# EAGLE design eTapper1main46 (EAGLE 8.4.3)
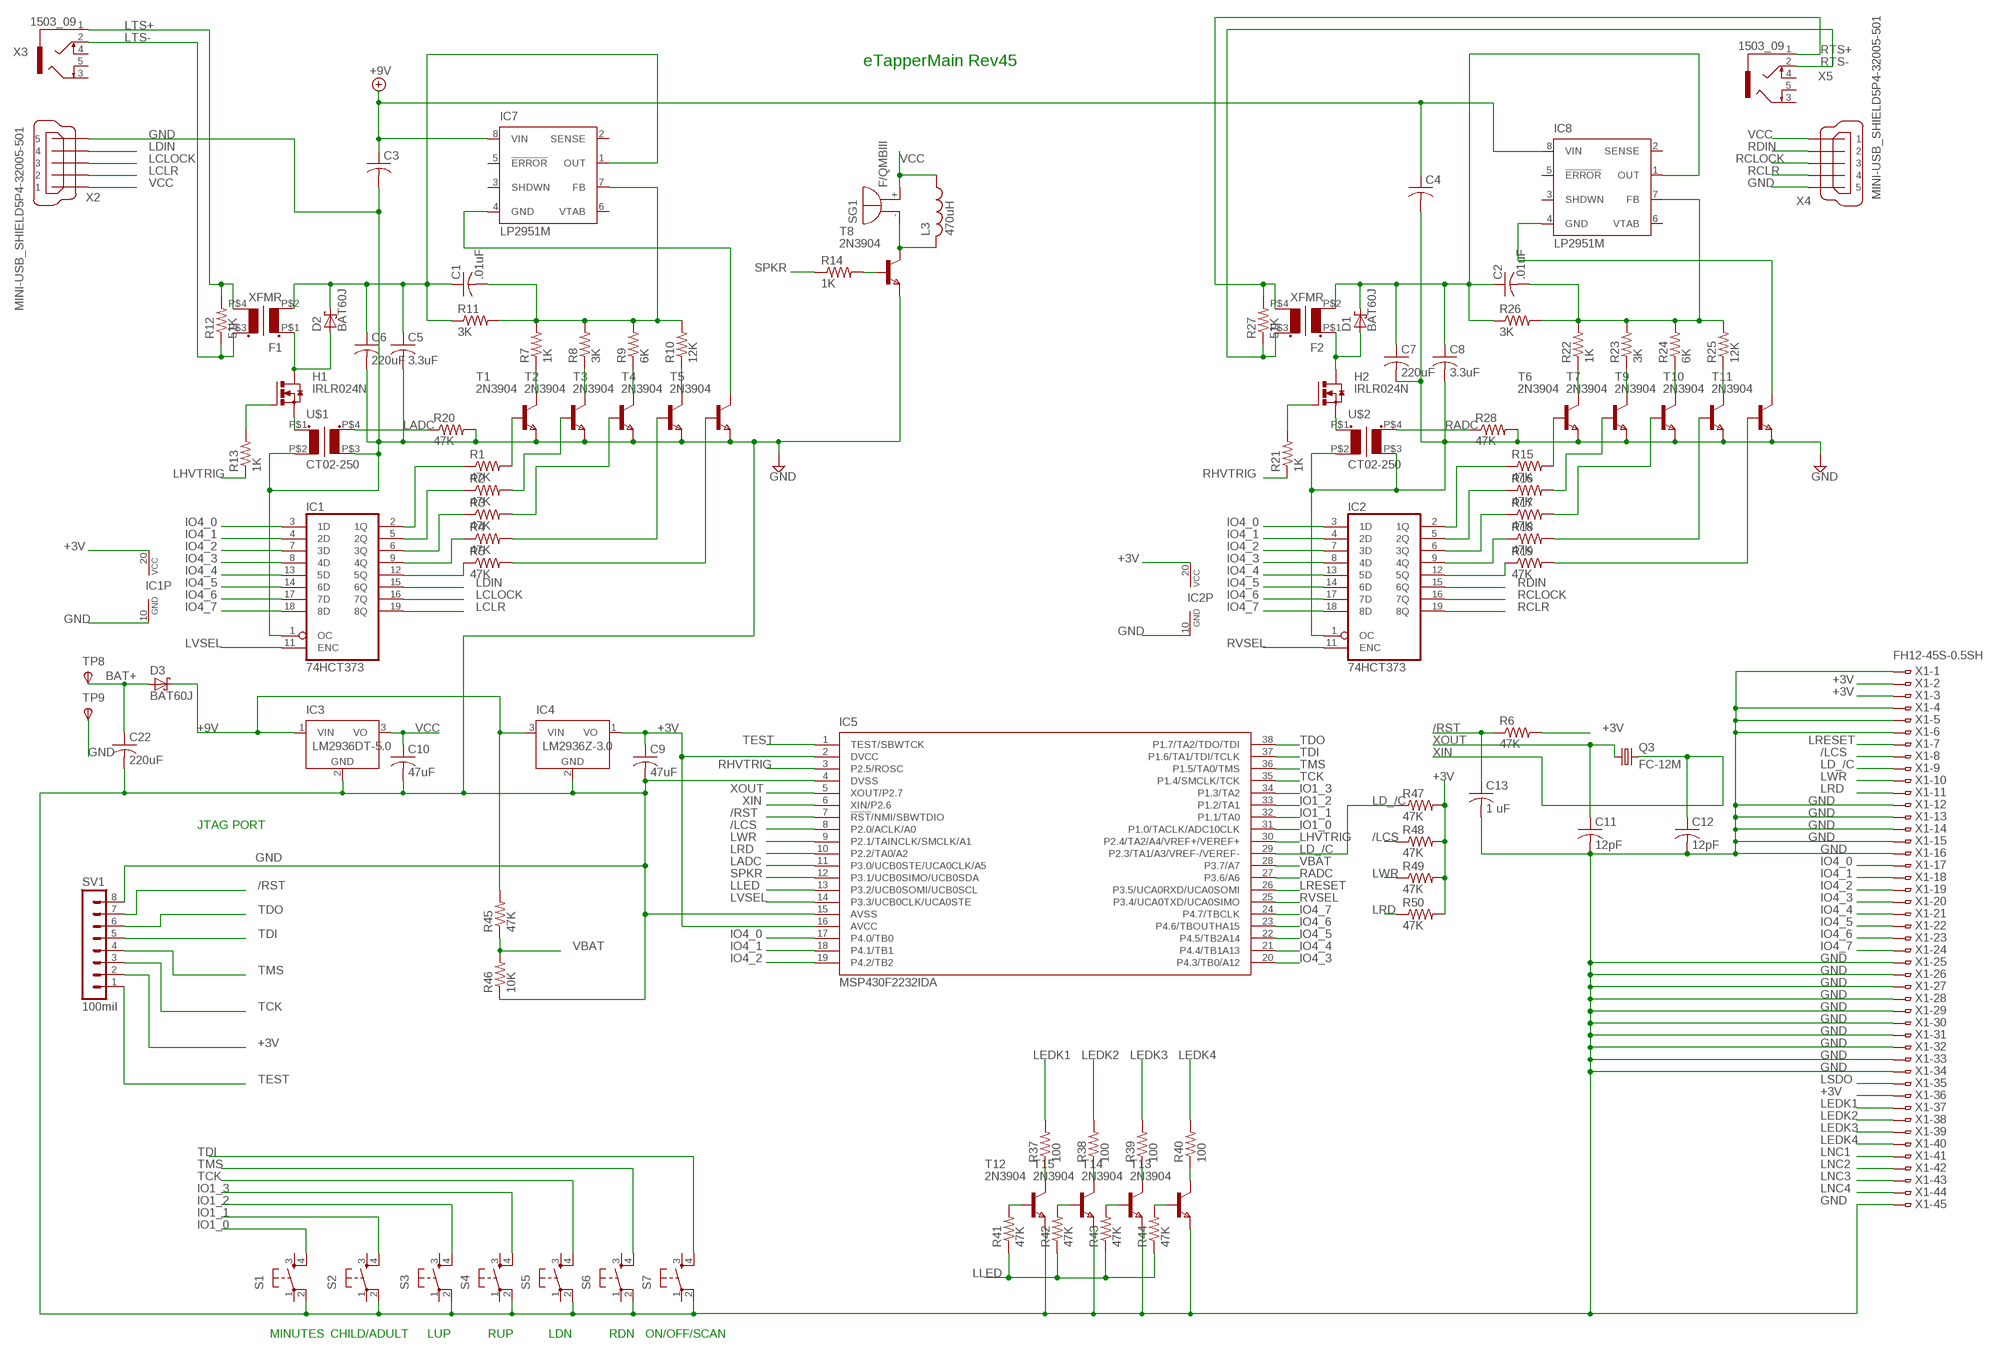
[diagram p0: schematic, sheet 1]

## Parts
C1  .01uF  C-USC0805  [C0805]
C2  .01uF  C-USC0805  [C0805]
C3  C-USC1206  [C1206]
C4  C-USC1206  [C1206]
C5  3.3uF  C-USC0805  [C0805]
C6  220uF  C-USC1206  [C1206]
C7  220uF  C-USC1206  [C1206]
C8  3.3uF  C-USC0805  [C0805]
C9  47uF  C-USC1206  [C1206]
C10  47uF  C-USC1206  [C1206]
C11  12pF  C-USC0805  [C0805]
C12  12pF  C-USC0805  [C0805]
C13  1 uF  C-USC0805  [C0805]
C22  220uF  C-USC1206  [C1206]
D1  BAT60J  [SOD323_ST]
D2  BAT60J  [SOD323_ST]
D3  BAT60J  [SOD323_ST]
F1  XFMR  [XFMR]
F2  XFMR  [XFMR]
H1  IRLR024N  [D-PAK_TO252AA]
H2  IRLR024N  [D-PAK_TO252AA]
IC1  74HCT373  [SO20]
IC2  74HCT373  [SO20]
IC3  LM2936DT-5.0  [TO252]
IC4  LM2936Z-3.0  [TO92]
IC5  MSP430F2232IDA  [TSSOP38_R-PDSO-G38-DA]
IC7  LP2951M  [SO08]
IC8  LP2951M  [SO08]
L3  470uH  L-USL2825P  [L2825P]
Q3  FC-12M  [FC-12M]
R1  47K  R-US_R0402  [R0402]
R2  47K  R-US_R0402  [R0402]
R3  47K  R-US_R0402  [R0402]
R4  47K  R-US_R0402  [R0402]
R5  47K  R-US_R0402  [R0402]
R6  47K  R-US_R0402  [R0402]
R7  1K  R-US_R0402  [R0402]
R8  3K  R-US_R0402  [R0402]
R9  6K  R-US_R0402  [R0402]
R10  12K  R-US_R0402  [R0402]
R11  3K  R-US_R0402  [R0402]
R12  51K  R-US_R0402  [R0402]
R13  1K  R-US_R0402  [R0402]
R14  1K  R-US_R0402  [R0402]
R15  47K  R-US_R0402  [R0402]
R16  47K  R-US_R0402  [R0402]
R17  47K  R-US_R0402  [R0402]
R18  47K  R-US_R0402  [R0402]
R19  47K  R-US_R0402  [R0402]
R20  47K  R-US_R0402  [R0402]
R21  1K  R-US_R0402  [R0402]
R22  1K  R-US_R0402  [R0402]
R23  3K  R-US_R0402  [R0402]
R24  6K  R-US_R0402  [R0402]
R25  12K  R-US_R0402  [R0402]
R26  3K  R-US_R0402  [R0402]
R27  51K  R-US_R0402  [R0402]
R28  47K  R-US_R0402  [R0402]
R37  100  R-US_R0402  [R0402]
R38  100  R-US_R0402  [R0402]
R39  100  R-US_R0402  [R0402]
R40  100  R-US_R0402  [R0402]
R41  47K  R-US_R0402  [R0402]
R42  47K  R-US_R0402  [R0402]
R43  47K  R-US_R0402  [R0402]
R44  47K  R-US_R0402  [R0402]
R45  47K  R-US_R0402  [R0402]
R46  10K  R-US_R0402  [R0402]
R47  47K  R-US_R0402  [R0402]
R48  47K  R-US_R0402  [R0402]
R49  47K  R-US_R0402  [R0402]
R50  47K  R-US_R0402  [R0402]
S1  10-XX  [B3F-10XX]
S2  10-XX  [B3F-10XX]
S3  10-XX  [B3F-10XX]
S4  10-XX  [B3F-10XX]
S5  10-XX  [B3F-10XX]
S6  10-XX  [B3F-10XX]
S7  10-XX  [B3F-10XX]
SG1  F/QMBIII  [F/QMBIII]
SV1  100mil  MA08-1  [MA08-1]
T1  2N3904  NPNSOT23  [SOT-23]
T2  2N3904  NPNSOT23  [SOT-23]
T3  2N3904  NPNSOT23  [SOT-23]
T4  2N3904  NPNSOT23  [SOT-23]
T5  2N3904  NPNSOT23  [SOT-23]
T6  2N3904  NPNSOT23  [SOT-23]
T7  2N3904  NPNSOT23  [SOT-23]
T8  2N3904  NPNSOT23  [SOT-23]
T9  2N3904  NPNSOT23  [SOT-23]
T10  2N3904  NPNSOT23  [SOT-23]
T11  2N3904  NPNSOT23  [SOT-23]
T12  2N3904  NPNSOT23  [SOT-23]
T13  2N3904  NPNSOT23  [SOT-23]
T14  2N3904  NPNSOT23  [SOT-23]
T15  2N3904  NPNSOT23  [SOT-23]
TP8  TPSPAD1-20  [P1-20]
TP9  TPSPAD1-20  [P1-20]
U$1  CT02-250  [CT02-250]
U$2  CT02-250  [CT02-250]
X1  FH12-45S-0.5SH  [FH12-45S-0.5SH]
X2  MINI-USB_SHIELD5P4-32005-501  [32005-501]
X3  1503_09  [1503_09]
X4  MINI-USB_SHIELD5P4-32005-501  [32005-501]
X5  1503_09  [1503_09]

## Nets
+3V [+3V]: C9.1 IC1.20(VCC) IC2.20(VCC) IC4.1(VO) IC5.2(DVCC) IC5.16(AVCC) R6.2 R47.2 R48.2 R49.2 R50.2 SV1.2 X1.2 X1.3 X1.36
+9V [+9V]: C3.1 C4.1 D3.C IC3.1(VIN) IC4.3(VIN) IC7.8(VIN) IC8.8(VIN) R45.2
/LCS: IC5.8(P2.0/ACLK/A0) R48.1 X1.8
/RST: C13.1 IC5.7(!RST!/NMI/SBWTDIO) R6.1 SV1.7
BAT+ [BAT+]: C22.1 D3.A TP8.TP(PP)
GND [GND]: C3.2 C4.2 C5.2 C6.2 C7.2 C8.2 C9.2 C10.2 C11.2 C12.2 C13.2 C22.2 IC1.1(OC) IC1.10(GND) IC2.1(OC) IC2.10(GND) IC3.2(GND) IC4.2(GND) IC5.4(DVSS) IC5.15(AVSS) R20.2 R28.2 R46.1 S1.2(P1) S2.2(P1) S3.2(P1) S4.2(P1) S5.2(P1) S6.2(P1) S7.2(P1) SV1.8 T1.2(E) T2.2(E) T3.2(E) T4.2(E) T5.2(E) T6.2(E) T7.2(E) T8.2(E) T9.2(E) T10.2(E) T11.2(E) T12.2(E) T13.2(E) T14.2(E) T15.2(E) TP9.TP(PP) U$1.P$2(P2) U$1.P$3(S2) U$2.P$2(P2) U$2.P$3(S2) X1.1 X1.4 X1.5 X1.6 X1.12 X1.13 X1.14 X1.15 X1.16 X1.25 X1.26 X1.27 X1.28 X1.29 X1.30 X1.31 X1.32 X1.33 X1.34 X1.45 X2.5 X4.5
IO1_0: IC5.31(P1.0/TACLK/ADC10CLK) S1.4(S1)
IO1_1: IC5.32(P1.1/TA0) S2.4(S1)
IO1_2: IC5.33(P1.2/TA1) S3.4(S1)
IO1_3: IC5.34(P1.3/TA2) S4.4(S1)
IO4_0: IC1.3(1D) IC2.3(1D) IC5.17(P4.0/TB0) X1.17
IO4_1: IC1.4(2D) IC2.4(2D) IC5.18(P4.1/TB1) X1.18
IO4_2: IC1.7(3D) IC2.7(3D) IC5.19(P4.2/TB2) X1.19
IO4_3: IC1.8(4D) IC2.8(4D) IC5.20(P4.3/TB0/A12) X1.20
IO4_4: IC1.13(5D) IC2.13(5D) IC5.21(P4.4/TB1A13) X1.21
IO4_5: IC1.14(6D) IC2.14(6D) IC5.22(P4.5/TB2A14) X1.22
IO4_6: IC1.17(7D) IC2.17(7D) IC5.23(P4.6/TBOUTHA15) X1.23
IO4_7: IC1.18(8D) IC2.18(8D) IC5.24(P4.7/TBCLK) X1.24
LADC: IC5.11(P3.0/UCB0STE/UCA0CLK/A5) R20.1 U$1.P$4(S1)
LCLOCK: IC1.16(7Q) X2.3
LCLR: IC1.19(8Q) X2.2
LD_/C: IC5.29(P2.3/TA1/A3/VREF-/VEREF-) R47.1 X1.9
LDIN: IC1.15(6Q) X2.4
LEDK1: R37.2 X1.37
LEDK2: R38.2 X1.38
LEDK3: R39.2 X1.39
LEDK4: R40.2 X1.40
LHVTRIG: IC5.30(P2.4/TA2/A4/VREF+/VEREF+) R13.1
LLED: IC5.13(P3.2/UCB0SOMI/UCB0SCL) R41.1 R42.1 R43.1 R44.1
LNC1: X1.41
LNC2: X1.42
LNC3: X1.43
LNC4: X1.44
LRD: IC5.10(P2.2/TA0/A2) R50.1 X1.11
LRESET: IC5.26(P3.5/UCA0RXD/UCA0SOMI) X1.7
LSDO: X1.35
LTS+: F1.P$4(S2) R12.2 X3.1
LTS-: F1.P$3(S1) R12.1 X3.2
LVSEL: IC1.11(ENC) IC5.14(P3.3/UCB0CLK/UCA0STE)
LWR: IC5.9(P2.1/TAINCLK/SMCLK/A1) R49.1 X1.10
N$1: IC1.2(1Q) R1.1
N$2: IC1.5(2Q) R2.1
N$3: IC1.6(3Q) R3.1
N$4: IC1.9(4Q) R4.1
N$5: IC1.12(5Q) R5.1
N$6: L3.2 SG1.-(+) T8.1(C)
N$7: R4.2 T4.3(B)
N$8: R5.2 T5.3(B)
N$9: D2.A F1.P$1(P1) H1.4(D)
N$10: R7.1 T1.1(C)
N$11: R8.1 T2.1(C)
N$12: R9.1 T3.1(C)
N$13: R1.2 T1.3(B)
N$14: R2.2 T2.3(B)
N$15: R3.2 T3.3(B)
N$16: R10.1 T4.1(C)
N$17: C1.2 IC7.7(FB) R7.2 R8.2 R9.2 R10.2 R11.2
N$18: C1.1 C5.1 C6.1 D2.C F1.P$2(P2) IC7.1(OUT) R11.1
N$19: D1.A F2.P$1(P1) H2.4(D)
N$20: IC2.2(1Q) R15.1
N$21: H1.1(G) R13.2
N$22: R14.2 T8.3(B)
N$23 [GND]: H1.3(S) U$1.P$1(P1)
N$24: IC2.5(2Q) R16.1
N$25: IC2.6(3Q) R17.1
N$26: IC2.9(4Q) R18.1
N$27: IC2.12(5Q) R19.1
N$28: R44.2 T13.3(B)
N$29: R15.2 T6.3(B)
N$30: R16.2 T7.3(B)
N$31: R17.2 T9.3(B)
N$32: R18.2 T10.3(B)
N$33: R19.2 T11.3(B)
N$35: R22.1 T6.1(C)
N$36: R23.1 T7.1(C)
N$37: R24.1 T9.1(C)
N$38: R25.1 T10.1(C)
N$39: C2.2 IC8.7(FB) R22.2 R23.2 R24.2 R25.2 R26.2
N$40: C2.1 C7.1 C8.1 D1.C F2.P$2(P2) IC8.1(OUT) R26.1
N$41: R37.1 T12.1(C)
N$42: H2.1(G) R21.2
N$43: R38.1 T15.1(C)
N$44: R39.1 T14.1(C)
N$45: IC7.4(GND) T5.1(C)
N$46: R40.1 T13.1(C)
N$47: IC8.4(GND) T11.1(C)
N$48: R43.2 T14.3(B)
N$49: R41.2 T12.3(B)
N$50: R42.2 T15.3(B)
N$51 [GND]: H2.3(S) U$2.P$1(P1)
RADC: IC5.27(P3.6/A6) R28.1 U$2.P$4(S1)
RCLOCK: IC2.16(7Q) X4.3
RCLR: IC2.19(8Q) X4.4
RDIN: IC2.15(6Q) X4.2
RHVTRIG: IC5.3(P2.5/ROSC) R21.1
RTS+: F2.P$4(S2) R27.2 X5.1
RTS-: F2.P$3(S1) R27.1 X5.2
RVSEL: IC2.11(ENC) IC5.25(P3.4/UCA0TXD/UCA0SIMO)
SPKR: IC5.12(P3.1/UCB0SIMO/UCB0SDA) R14.1
TCK: IC5.35(P1.4/SMCLK/TCK) S5.4(S1) SV1.3
TDI: IC5.37(P1.6/TA1/TDI/TCLK) S7.4(S1) SV1.5
TDO: IC5.38(P1.7/TA2/TDO/TDI) SV1.6
TEST: IC5.1(TEST/SBWTCK) SV1.1
TMS: IC5.36(P1.5/TA0/TMS) S6.4(S1) SV1.4
VBAT: IC5.28(P3.7/A7) R45.1 R46.2
VCC [VCC]: C10.1 IC3.3(VO) L3.1 SG1.+(-) X2.1 X4.1
XIN: C12.1 IC5.6(XIN/P2.6) Q3.2
XOUT: C11.1 IC5.5(XOUT/P2.7) Q3.1
Unconnected: IC7.2(SENSE) IC7.3(SHDWN) IC7.5(!ERROR) IC7.6(VTAB) IC8.2(SENSE) IC8.3(SHDWN) IC8.5(!ERROR) IC8.6(VTAB) S1.1(P) S1.3(S) S2.1(P) S2.3(S) S3.1(P) S3.3(S) S4.1(P) S4.3(S) S5.1(P) S5.3(S) S6.1(P) S6.3(S) S7.1(P) S7.3(S) X2.M1(S1) X2.M2(S2) X2.M3(S3) X2.M4(S4) X3.3 X3.4 X3.5 X4.M1(S1) X4.M2(S2) X4.M3(S3) X4.M4(S4) X5.3 X5.4 X5.5

## Notes on the sheet
- eTapperMain Rev45
- JTAG PORT
- MINUTES | CHILD/ADULT | LUP | RUP | LDN | RDN | ON/OFF/SCAN

## Library data of the parts
C1-C13 C22 = rcl:C-US: CAPACITOR, American symbol
D1-D3 = diode:BAT60J: Schottky barrier diode Source: www.st.com, BAT60J.pdf
F1 F2 = XFMR1:XFMR: Transformer 1"X1" 0.4"X0.4" hole separation for e_tapper
H1 H2 = IRLR024N:IRLR024N: IRLR024N HEXFET Power Mosfet N channel Infeneon Technology TO-251AA IPAK
IC1 IC2 = 74373_SO20:74*373: Octal D type transparent LATCH, edge triggered
IC3 = national-semiconductor:LM2936?*: Ultra-Low Quiescent Current LDO Voltage Regulator Source: Data sheet <http://www.national.com/ds/LM/LM2936.pdf>; MF: NATIONAL SEMICONDUCTOR; MPN: LM2936DT-5.0/NOPB; OC_FARNELL: 1286864; OC_NEWARK: 41K4501
IC4 = national-semiconductor:LM2936?*: Ultra-Low Quiescent Current LDO Voltage Regulator Source: Data sheet <http://www.national.com/ds/LM/LM2936.pdf>; MF: NATIONAL SEMICONDUCTOR; MPN: LM2936Z-3.0/NOPB; OC_FARNELL: 1312709; OC_NEWARK: 41K4531
IC5 = texas:MSP430F22*2IDA: MIXED SIGNAL MICROCONTROLLER Source: http://focus.ti.com/lit/ds/symlink/msp430f2274.pdf; MPN: MSP430F2232IDA; OC_FARNELL: 1610178; OC_NEWARK: 28M6312
IC7 IC8 = national-semiconductor:LP2951: Adjustable Micropower Voltage Regulator Source: http://www.national.com/ds/LP/LP2950.pdf; MF: FAIRCHILD SEMICONDUCTOR; MPN: LP2951CM; OC_FARNELL: 9488561; OC_NEWARK: 78K6014
L3 = rcl:L-US: INDUCTOR, American symbol
Q3 = crystal:FC-12M: kHz RANGE CRYSTAL UNIT LOW PROFILE SMD Source: Epson Toyocom FC-12M.pdf
R1-R28 R37-R50 = resistor:R-US_: RESISTOR, American symbol
S1-S7 = switch-omron:10-XX: OMRON SWITCH; MPN: B3F-1000; OC_FARNELL: 176432; OC_NEWARK: 36M3542
SG1 = buzzer:F/QMBIII: BUZZER Source: Buerklin; OC_FARNELL: unknown; OC_NEWARK: unknown
SV1 = con-lstb:MA08-1: PIN HEADER; OC_FARNELL: unknown; OC_NEWARK: unknown
T1-T15 = zetex:NPNSOT23: NPN TRANSISTOR; MPN: DSS20201L-7; OC_FARNELL: 1710688; OC_NEWARK: 25R4555
TP8 TP9 = testpad:TPS: TEST PIN
U$1 U$2 = CT02-250:CT02-250: Current Transformer ICE Components 1:250 turns ratio
X1 = con-hirose:FH12-45S-0.5S: 0.5mm Pitch Connectors For FPC/FFC Source: Data sheet <http://www.hirose.co.jp/cataloge_hp/e58605370.pdf>; OC_FARNELL: unknown; OC_NEWARK: unknown
X2 X4 = con-cypressindustries:MINI-USB_SHIELD5P4-: MINI USB-B R/A W/O POST 5 pol. Source: www.cypressindustries.com; OC_FARNELL: unknown; OC_NEWARK: unknown
X3 X5 = con-lumberg:1503_09: Jack connectors according to JISC 6560, 3.5 mm Klinkeneinbaukupplung nach JISC 6560, 3,5 mm, 3-polig/ stereo, abgewinkelte Ausführung, mit 2 Öffnern und Lötaugen, für Leiterplatten Rückseitenmontage Source: http://www.lumberg.com/Produkte/PDFs/1503_09.pdf; OC_FARNELL: 1243244; OC_NEWARK: unknown

## Module LP2951
Ports: 

### Library data of the parts

## Net classes
1 GND: width 0.305 mm, clearance 0.152 mm
2 BAT+: width 0.305 mm, clearance 0.152 mm
3 +9V: width 0.305 mm, clearance 0.152 mm
4 +3V: width 0.305 mm, clearance 0.152 mm
5 VCC: width 0.305 mm, clearance 0.152 mm

## Board
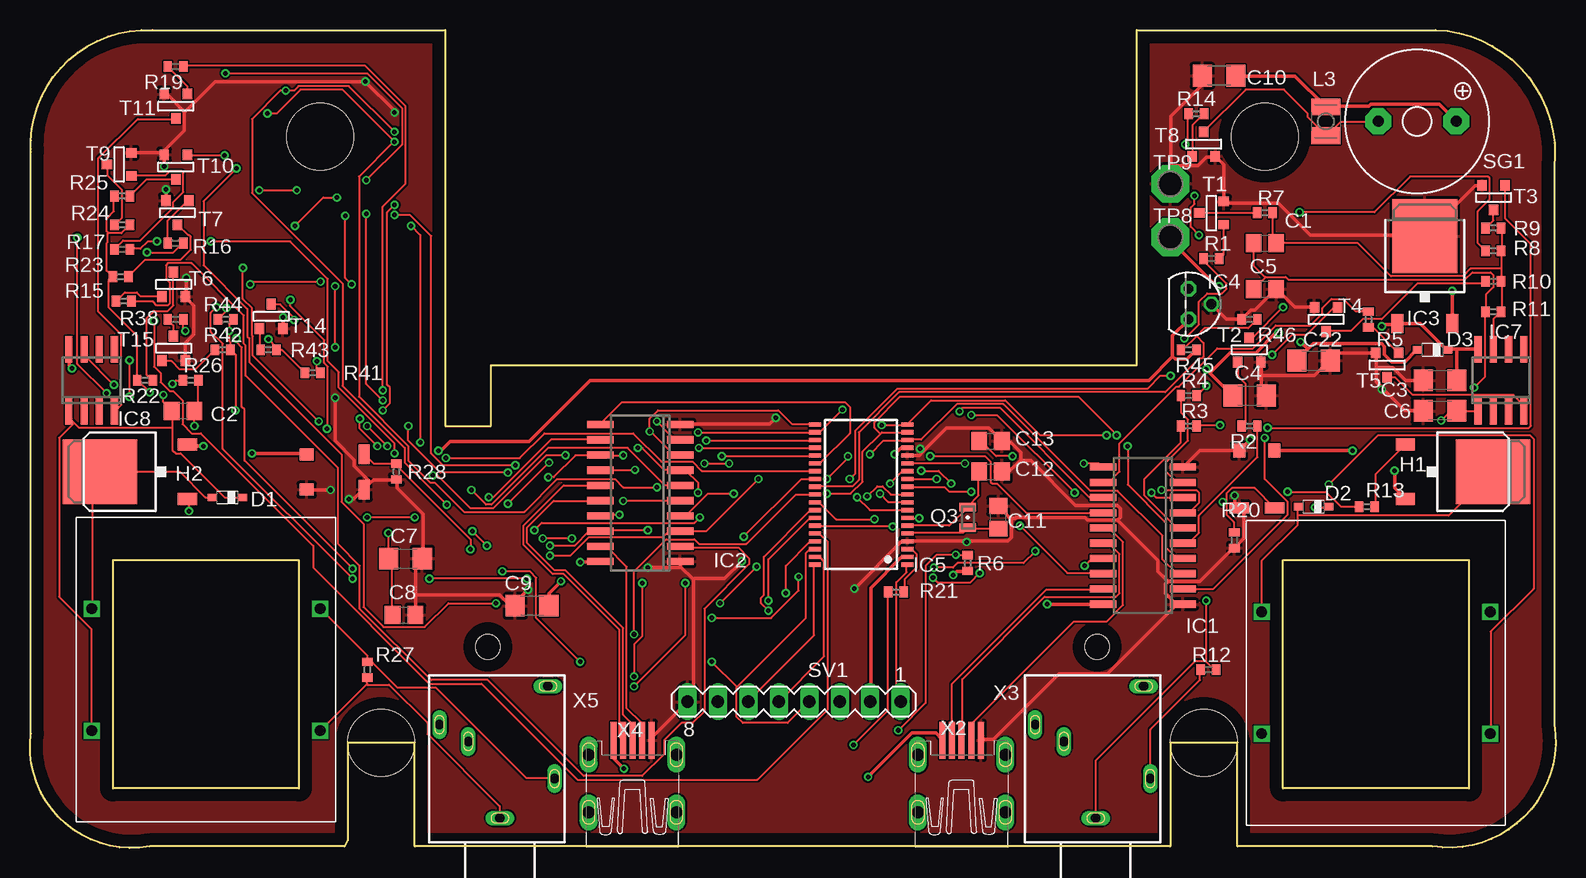
[diagram p1: board, top side]
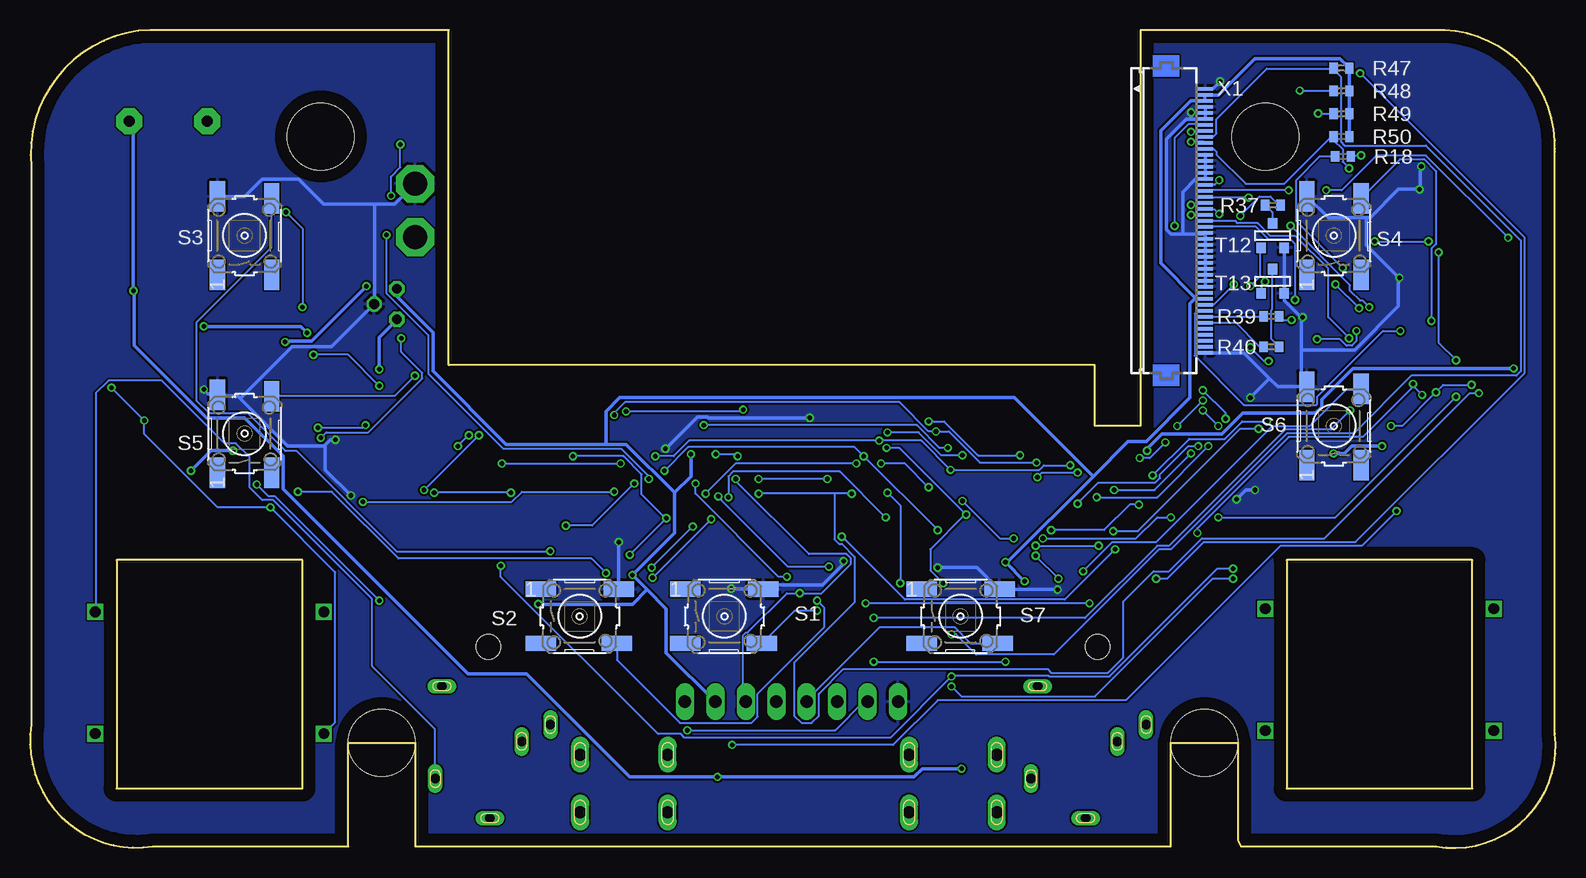
[diagram p2: board, bottom side, seen from below]

Size 127.17 x 68.21 mm. Coordinates in mm from the lower left corner, seen from the top.
Outline: 0.06,58.04 0.06,58.3 0.06,9.53
Outline: 0.06,58.04 0.06,9.53
Outline: 0.06,58.04 arc-96 10.22,68.2 34.61,68.2 34.61,35.18 38.42,35.18 38.42,40.26 92.27,40.26 92.27,68.2 117.16,68.2 arc-94 127.06,56.77 127.06,10.29 arc-108 116.9,0.13 100.65,0.13 100.65,8.77 95.06,8.77 95.06,0.13 32.07,0.13 32.07,8.77 26.48,8.77 26.48,0.64 26.23,0.13 9.97,0.13 arc-107 0.06,9.53
Outline: 104.46,24.01 119.95,24.01 119.95,4.96 104.46,4.96 104.46,24.01
Outline: 6.92,24.01 22.42,24.01 22.42,4.96 6.92,4.96 6.92,24.01
Copper layers (1*16): Top 0.035mm / dielectric 30mil / Bottom 0.035mm
Design rules "default *": minimum track width 6mil, minimum drill 15mil, track to track 6mil, track to pad 6mil, pad to pad 6mil, via to via 6mil, smd to smd 6mil, copper to edge 40mil, drill to drill 6mil, minimum pad ring 6mil, minimum via ring 6mil, stop-mask expansion 4mil, vias tented up to drill 0mil, thermal gap 10mil
Holes 5.59 mm at 24.19,59.31 102.93,59.31 29.27,8.77 97.85,8.77
Holes 2.03 mm at 38.16,16.77 88.96,16.77

### Footprints (pad centres in the part's own frame; a part is rotated, then mirrored left to right if it is on the bottom)
C0805 = smd 1.3 x 1.5: 1 -0.95,0; 2 0.95,0
C1206 = smd 1.6 x 1.8: 1 -1.4,0; 2 1.4,0
SOD323_ST = smd 0.8 x 0.6: A 1.25,0; C -1.25,0
XFMR = drill 0.889 square: P$1 -10.16,5.08; P$2 -10.16,-5.08; P$3 8.89,5.08; P$4 8.89,-5.08
D-PAK_TO252AA = smd 1 x 1.6: 1 -2.28,-4.8; 3 2.28,-4.8 | smd 5.4 x 6.2: 4 0,2.5
SO20 = smd 0.6 x 2.2: 1 -5.715,-3.33; 2 -4.445,-3.33; 3 -3.175,-3.33; 4 -1.905,-3.33; 5 -0.635,-3.33; 6 0.635,-3.33; 7 1.905,-3.33; 8 3.175,-3.33; 9 4.445,-3.33; 10 5.715,-3.33; 11 5.715,3.33; 12 4.445,3.33; 13 3.175,3.33; 14 1.905,3.33; 15 0.635,3.33; 16 -0.635,3.33; 17 -1.905,3.33; 18 -3.175,3.33; 19 -4.445,3.33; 20 -5.715,3.33
TO252 = smd 1 x 1.6: 1 -2.28,-4.8; 3 2.28,-4.8 | smd 5.4 x 6.2: 2 0,2.5
TO92 = drill 0.813 pad 1.27 octagon: 1 -1.27,0; 2 0,1.905; 3 1.27,0
TSSOP38_R-PDSO-G38-DA = smd 0.35 x 1: 1 -5.85,-3.85; 2 -5.2,-3.85; 3 -4.55,-3.85; 4 -3.9,-3.85; 5 -3.25,-3.85; 6 -2.6,-3.85; 7 -1.95,-3.85; 8 -1.3,-3.85; 9 -0.65,-3.85; 10 0,-3.85; 11 0.65,-3.85; 12 1.3,-3.85; 13 1.95,-3.85; 14 2.6,-3.85; 15 3.25,-3.85; 16 3.9,-3.85; 17 4.55,-3.85; 18 5.2,-3.85; 19 5.85,-3.85; 20 5.85,3.85; 21 5.2,3.85; 22 4.55,3.85; 23 3.9,3.85; 24 3.25,3.85; 25 2.6,3.85; 26 1.95,3.85; 27 1.3,3.85; 28 0.65,3.85; 29 0,3.85; 30 -0.65,3.85; 31 -1.3,3.85; 32 -1.95,3.85; 33 -2.6,3.85; 34 -3.25,3.85; 35 -3.9,3.85; 36 -4.55,3.85; 37 -5.2,3.85; 38 -5.85,3.85
SO08 = smd 0.6 x 2.2: 1 -1.905,-2.6; 2 -0.635,-2.6; 3 0.635,-2.6; 4 1.905,-2.6; 5 1.905,2.6; 6 0.635,2.6; 7 -0.635,2.6; 8 -1.905,2.6
L2825P = smd 1.4 x 2.4: 1 -1.2,0; 2 1.2,0
FC-12M = smd 0.7 x 1.4: 1 -0.85,0; 2 0.85,0
R0402 = smd 0.7 x 0.9: 1 -0.65,0; 2 0.65,0
B3F-10XX = smd 2.54 x 1.27: 1 -3.251,2.261; 2 3.251,2.261; 3 -3.251,-2.261; 4 3.099,-2.261
F/QMBIII = drill 0.914 pad 2.159 octagon: + 3.251,0; - -3.251,0
MA08-1 = drill 1.016 long: 1 -8.89,0; 2 -6.35,0; 3 -3.81,0; 4 -1.27,0; 5 1.27,0; 6 3.81,0; 7 6.35,0; 8 8.89,0
SOT-23 = smd 0.787 x 0.889: 1 0.025,-1.016; 2 -0.94,1.016; 3 0.991,1.016
P1-20 = drill 2.007 pad 3.15 octagon: TP 0,0
CT02-250 = smd 1 x 1.2: P$1 -1.45,-2.4; P$2 1.5,-2.4 | smd 1.6 x 0.9: P$3 1.5,2.4; P$4 -1.45,2.4
FH12-45S-0.5SH = smd 0.3 x 1.3: 1 -13,3.25; 2 -12.5,3.25; 3 -12,3.25; 4 -11.5,3.25; 5 -11,3.25; 6 -10.5,3.25; 7 -10,3.25; 8 -9.5,3.25; 9 -9,3.25; 10 -8.5,3.25; 11 -8,3.25; 12 -7.5,3.25; 13 -7,3.25; 14 -6.5,3.25; 15 -6,3.25; 16 -5.5,3.25; 17 -5,3.25; 18 -4.5,3.25; 19 -4,3.25; 20 -3.5,3.25; 21 -3,3.25; 22 -2.5,3.25; 23 -2,3.25; 24 -1.5,3.25; 25 -1,3.25; 26 -0.5,3.25; 27 0,3.25; 28 0.5,3.25; 29 1,3.25; 30 1.5,3.25; 31 2,3.25; 32 2.5,3.25; 33 3,3.25; 34 3.5,3.25; 35 4,3.25; 36 4.5,3.25; 37 5,3.25; 38 5.5,3.25; 39 6,3.25; 40 6.5,3.25; 41 7,3.25; 42 7.5,3.25; 43 8,3.25; 44 8.5,3.25; 45 9,3.25
32005-501 = smd 3.1 x 0.5: 1 3,1.6; 2 3,0.8; 3 3,0; 4 3,-0.8; 5 3,-1.6 | drill 1 pad 1.422 long: M1 -3,3.65; M2 -3,-3.65; M3 1.8,3.65; M4 1.8,-3.65
1503_09 = drill 0.8 pad 1.2 long: 1 0,-2.1; 2 -4.55,-5.4; 3 5.05,-9.9; 4 -4,-13.1; 5 2.65,-8.5

### Placement (x,y rotation side)
C1  102.93,50.42 0 top
C2  12.76,36.45 0 top
C3  117.54,38.99 180 top
C4  101.66,37.72 0 top
C5  102.93,46.61 0 top
C6  117.54,36.45 180 top
C7  31.31,24.14 0 top
C8  31.18,19.44 0 top
C9  41.85,20.2 180 top
C10  99.12,64.39 180 top
C11  80.71,27.56 90 top
C12  80.07,31.37 0 top
C13  80.07,33.91 0 top
C22  107,40.65 0 top
D1  16.45,29.22 180 top
D2  107,28.45 180 top
D3  116.9,41.53 180 top
DRILEGEND  [DRILEGEND]  -4.51,-8.34 0 top  (outside the outline)
F1  112.84,14.61 0 top
F2  15.3,14.86 0 top
H1  119.44,31.37 270 top
H2  8.32,31.37 90 top
IC1  92.77,26.04 90 top
IC2  50.86,29.6 90 top
IC3  116.27,48.52 0 top
IC4  96.58,45.34 270 top
IC5  69.28,29.47 90 top
IC7  122.62,38.99 0 top
IC8  5.14,38.99 0 top
L3  108.01,60.58 270 top
Q3  78.17,27.56 90 top
R1  98.49,49.15 0 top
R2  101.66,35.18 180 top
R3  96.58,35.18 0 top
R4  96.58,37.72 0 top
R5  111.57,44.07 270 top
R6  78.17,23.75 270 top
R7  102.93,52.96 0 top
R8  121.98,49.79 0 top
R9  121.98,51.69 0 top
R10  121.98,47.25 0 top
R11  121.98,44.71 0 top
R12  98.23,14.86 0 top
R13  111.44,28.45 0 top
R14  97.22,61.22 0 top
R15  7.81,45.6 180 top
R16  12.13,50.42 180 top
R17  7.68,49.92 180 top
R18  17.72,57.66 0 bottom
R19  12.13,65.16 180 top
R20  100.39,25.66 270 top
R21  72.2,21.34 180 top
R22  9.59,38.99 180 top
R23  7.56,47.63 180 top
R24  7.68,51.95 0 top
R25  7.68,54.36 180 top
R26  13.4,38.99 0 top
R27  28.13,14.86 270 top
R28  30.54,31.37 270 top
R37  23.56,53.6 0 bottom
R38  12.13,44.07 0 top
R39  23.69,44.33 180 bottom
R40  23.69,41.79 180 bottom
R41  23.56,39.63 0 top
R42  16.07,41.53 180 top
R43  19.88,41.53 180 top
R44  16.32,44.07 180 top
R45  96.58,41.53 0 top
R46  101.66,44.07 0 top
R47  17.84,65.03 0 bottom
R48  17.84,63.12 0 bottom
R49  17.84,61.22 0 bottom
R50  17.84,59.31 0 bottom
S1  69.28,19.31 0 bottom
S2  81.34,19.31 0 bottom
S3  109.28,51.06 90 bottom
S4  18.48,51.06 90 bottom
S5  109.28,34.55 90 bottom
S6  18.48,35.18 90 bottom
S7  49.59,19.31 0 bottom
SG1  115.63,60.58 0 top
SV1  63.69,12.2 180 top
T1  98.49,52.96 270 top
T2  101.66,41.53 180 top
T3  121.98,54.23 0 top
T4  108.01,44.07 0 top
T5  113.09,40.26 0 top
T6  12,47 180 top
T7  12.26,52.96 0 top
T8  97.85,58.68 180 top
T9  7.43,57.03 270 top
T10  12.13,56.77 0 top
T11  12.13,61.85 0 top
T12  23.56,51.06 180 bottom
T13  23.56,47.25 180 bottom
T14  20.13,44.33 180 top
T15  12,41.66 180 top
TP8  95.06,50.93 0 top
TP9  95.06,55.38 0 top
U$1  102.3,30.74 180 top
U$2  25.46,31.37 270 top
X1  32.45,50.3 270 bottom
X2  77.66,5.97 90 top
X3  88.84,0.39 180 top
X4  50.23,5.97 90 top
X5  39.18,0.39 180 top

### Tracks (layer width: path | path; a pad name or v marks a point on that pad's centre or on a via)
+3V  (via drill 0.38)
  Top 0.305: v76.95,22.76 77.25,23.07 78.17,23.07 R6.2 | IC5.2 73.06,24.21 72.61,24.21 70.09,21.7 70.09,12.25 SV1.2 | v72.07,32.82 72.61,33.36 73.06,33.36 IC5.16 | v84.8,20.33 IC1.20 | v44.26,22.23 43.27,21.24 43.27,20.25 C9.1 | v45.86,23.83 47.46,23.83 IC2.20
  Bottom 0.305: 75.73,21.54 74.13,19.94 74.13,16.29 SV1.2 | 75.73,21.54 v76.95,22.76 73.44,26.27 73.44,29.62 | v72.07,32.82 72.07,30.99 73.44,29.62 | v84.8,20.33 76.95,20.33 75.73,21.54 | 79.16,33.66 77.48,33.66 73.44,29.62 | 79.16,33.66 87.46,33.66 93.56,39.76 93.56,42.96 96.53,45.93 96.53,46.61 IC4.1 | v44.26,22.23 v45.86,23.83 45.71,23.83 38.54,30.99 | R50.2 17.21,59.34 17.21,61.17 R49.2 17.21,61.32 17.21,63.07 R48.2 17.21,63.23 17.21,64.98 R47.2 17.28,65.13 17.97,65.82 25.06,65.82 28.11,62.77 29.1,62.77 X1.2 29.25,62.77 29.25,62.31 | 30.01,45.85 32.91,48.75 32.91,59.8 30.39,62.31 29.25,62.31 | 30.01,45.85 29.93,45.78 29.25,45.78 X1.36 | 29.25,62.31 X1.3 | 38.54,30.99 35.65,33.89 34.12,33.89 30.47,37.55 30.47,45.4 30.01,45.85 | 79.16,33.66 79.16,36.4 78.02,37.55 45.1,37.55 38.54,30.99
+9V  (via drill 0.38)
  Top 0.305: 118.94,41.59 120.69,41.59 IC7.8 | 118.94,41.59 118.17,41.59 D3.C 118.02,41.59 115.89,43.72 114.06,43.72 IC3.1 113.91,43.64 112.84,43.64 v112.69,43.49 | 118.94,41.59 C3.1 | 95.24,40.98 95.47,40.75 96.46,40.75 97.22,41.51 R45.2 | 95.24,40.98 95.24,42.73 IC4.3 | v98.06,39.91 98.36,39.6 | 98.36,39.6 100.19,37.78 C4.1 | v3.49,39.99 3.26,40.21 3.26,41.59 IC8.8 | v34.05,33.13 34.28,33.13 35.04,33.89 41.59,33.89 46.7,38.99 93.26,38.99 95.24,40.98 | v104.08,42.96 103.85,42.96 102.17,41.28 100.04,41.28 98.36,39.6
  Bottom 0.305: v98.06,39.91 98.06,42.58 96.61,44.02 IC4.3 | v3.49,39.99 16.9,39.99 19.49,37.39 19.49,36.78 20.03,36.25 26.05,36.25 27.8,34.5 32.83,34.5 34.05,33.28 v34.05,33.13 | v112.69,43.49 104.61,43.49 v104.08,42.96
/LCS  (via drill 0.38)
  Top 0.152: v30.39,59.72 26.58,63.53 22.39,63.53 22.01,63.15 v21.32,63.15 20.87,63.15 18.5,60.79 18.5,54.62 26.05,47.07 26.05,38.54 31.23,33.36 31.23,32.14 v34.73,28.63 | v68.95,29.24 70.02,28.17 73.06,28.17 IC5.8 | v55.84,27.56 55.38,27.11 42.66,27.11 v42.05,26.5
  Bottom 0.152: v21.32,63.15 18.5,63.15 R48.1 | v30.39,59.72 29.32,59.72 29.25,59.8 X1.8 | v68.95,29.24 68.95,30.99 68.57,31.37 59.65,31.37 v55.84,27.56 | v42.05,26.5 37.63,26.5 35.5,28.63 v34.73,28.63
/RST  (via drill 0.38)
  Top 0.152: v74.13,27.49 73.14,27.49 IC5.7 | R6.1 78.17,24.44 v77.18,24.44 75.58,24.44 74.66,23.53 74.66,12.1 v72.38,9.81 | v81.9,32.67 80.53,32.67 79.31,33.89 79.16,33.89 C13.1
  Bottom 0.152: v77.18,24.44 v74.13,27.49 74.21,27.49 76.19,29.47 76.19,31.15 77.71,32.67 v81.9,32.67 | v72.38,9.81 60.03,9.81 57.67,12.17 57.37,12.17 SV1.7
BAT+  (via drill 0.38)
  Top 0.305: 106.51,41.59 105.6,40.67 C22.1 | 106.51,41.59 106.97,42.04 112.69,42.04 112.92,41.81 112.92,41.13 113.53,40.52 114.59,40.52 115.58,41.51 D3.A | v105.91,42.19 106.51,41.59 | v99.12,46.84 98.89,46.84 95.08,50.65 95.08,50.88 TP8.TP
  Bottom 0.305: v105.91,42.19 105.6,42.19 105.52,42.27 103.7,42.27 v99.12,46.84
GND  (via drill 0.38)
  Top 0.305: v21.09,44.25 21.09,43.34 T14.2 | T15.2 12.94,42.12 13.63,42.8 13.63,45.24 12.94,45.93 T6.2 13.02,46.08 v13.02,47.53 | v11.34,54.92 11.34,54.01 T7.2 | T9.2 11.04,57.97 11.19,57.82 T10.2 | 12.87,61.4 11.42,62.85 11.19,62.85 T11.2 | 12.87,61.4 12.87,59.8 11.11,58.04 T10.2 | 12.87,61.4 12.94,61.4 15.46,63.91 v27.95,63.91 30.39,61.47 v30.39,61.32 | T10.2 v11.19,56.83 | 54.24,23.45 54.24,23.83 IC2.1 | 55.31,22.38 54.24,23.45 | 55.31,22.38 55.31,12.71 SV1.8 51.88,9.28 51.88,9.05 X4.5 | 28.41,30.46 27.88,29.93 U$2.P$3 27.72,29.85 26.96,29.09 v26.58,29.09 | 28.41,30.46 28.64,30.69 30.54,30.69 R28.2 30.62,30.61 30.62,30 32.75,27.87 32.75,24.21 C7.2 32.68,24.14 32.14,23.6 32.14,21.09 | v25.06,29.85 23.08,29.85 U$2.P$2 | 32.14,21.09 32.14,19.49 C8.2 | 32.14,21.09 39.15,21.09 39.99,20.25 40.37,20.25 C9.2 40.37,20.4 v41.52,21.54 | v51.5,23.37 54.17,23.37 54.24,23.45 | v25.44,37.55 25.44,33.97 27.04,32.37 27.04,31.83 28.41,30.46 | IC1.10 96.15,31.76 97.52,33.13 100.72,33.13 U$1.P$2 100.88,33.2 v101.71,34.04 | 102.63,39.38 102.63,38.16 103.01,37.78 C4.2 | 102.63,39.38 102.63,40.52 T2.2 | 112.76,38.31 112.23,38.84 112.23,40.06 | 112.76,38.31 114.59,36.48 116.12,36.48 C6.2 | 112.23,40.06 112.23,41.2 T5.2 109.03,41.28 108.42,40.67 C22.2 108.27,40.59 107.05,39.38 102.63,39.38 | C3.2 114.67,38.99 113.6,40.06 112.23,40.06 | v112.69,38.23 112.76,38.31 | T3.2 120.99,55.23 120.46,55.23 116.27,51.03 IC3.2 116.19,51.11 106.74,51.11 104.08,53.78 99.58,53.78 T1.2 99.5,56.98 98.82,57.66 T8.2 98.67,57.59 98.06,57.59 97.37,56.9 95.16,56.9 TP9.TP 95.08,55.38 95.08,61.02 97.68,63.61 97.68,64.37 C10.2
  Top 0.305: T4.2 105.45,45.09 103.92,46.61 C5.2 103.77,46.54 102.1,44.86 101.79,44.86 101.1,44.18 R46.1 100.95,44.1 99.73,44.1 IC4.2 | 74.43,33.05 76.42,35.03 79.92,35.03 80.99,33.97 C13.2 81.14,33.81 81.75,33.81 82.59,32.97 82.59,32.37 | 74.43,33.05 74.13,32.75 73.14,32.75 IC5.15 | C12.2 81.6,31.37 82.59,32.37 | v62.17,35.87 61.63,35.34 54.24,35.34 IC2.10 | 74.43,33.05 v74.21,33.28 | 78.09,25.58 81.52,25.58 81.83,25.89 81.83,27.41 | 78.09,25.58 73.14,25.58 IC5.4 72.99,25.51 72.61,25.51 v68.72,21.62 | 81.83,27.41 80.76,28.48 C11.2 | v78.09,25.51 78.09,25.58 | 94.86,22.23 94.63,22 94.63,21.24 95.54,20.33 IC1.1 95.54,20.25 89.83,14.53 85.79,14.53 80.3,9.05 79.31,9.05 X2.5 | 94.86,22.23 97.52,22.23 100.27,24.97 R20.2 100.42,25.05 101.18,25.81 101.18,27.95 100.8,28.33 U$1.P$3 100.72,28.48 100.42,28.78 v100.42,29.39 | 90.67,27.34 88.15,27.34 87.92,27.56 82.21,27.56 82.13,27.49 81.9,27.49 81.83,27.41 | 90.67,27.34 94.02,23.98 94.02,23.07 94.86,22.23 | 90.67,27.34 90.89,27.56 90.89,28.33 90.67,28.56 87.16,28.56 83.43,32.29 82.66,32.29 82.59,32.37 | v59.35,23.91 57.9,22.46 55.38,22.46 55.31,22.38
  Bottom 0.305: T12.2 T13.2 22.62,45.62 21.25,44.25 v21.09,44.25 21.17,44.18 21.17,41.51 | 23.84,39.15 23.15,38.46 20.79,38.46 S6.2 21.17,38.54 21.17,41.51 | 23.84,39.15 25.97,41.28 29.17,41.28 X1.45 | 15.76,52.56 18.96,52.56 20.71,54.31 S4.2 | 15.76,52.56 15.46,52.56 13.09,54.92 v11.34,54.92 11.26,55 11.26,56.75 v11.19,56.83 | 15.76,52.56 15.76,50.27 v13.02,47.53 13.09,47.45 13.09,45.17 16.75,41.51 21.17,41.51 | X1.12 29.17,57.74 29.17,57.43 X1.13 29.17,57.28 29.17,56.9 X1.14 29.17,56.75 29.17,56.44 X1.15 29.17,56.29 29.17,55.83 X1.16 29.32,55.76 30.01,55.76 31.08,54.69 31.08,51.19 | X1.4 29.17,61.78 29.17,61.4 X1.5 29.17,61.24 29.17,60.86 X1.6 29.32,60.79 30.39,60.79 | X1.34 29.17,46.84 29.17,47.22 X1.33 29.17,47.45 29.17,47.76 X1.32 29.17,47.91 29.17,48.29 X1.31 29.17,48.44 29.17,48.75 X1.30 29.17,48.9 29.17,49.28 X1.29 29.17,49.43 29.17,49.74 X1.28 29.17,49.89 29.17,50.27 X1.27 29.17,50.42 29.17,50.73 X1.26 29.17,50.88 29.17,51.26 X1.25 29.25,51.19 31.08,51.19 | 30.39,60.79 30.77,60.79 32.45,59.11 32.45,51.57 32.07,51.19 31.08,51.19 | v27.95,63.91 28.56,63.3 29.17,63.3 X1.1 | v30.39,61.32 30.39,60.79 | v25.06,29.85 25.82,29.85 v26.58,29.09 | v41.52,21.54 46.32,21.54 S7.2 46.47,21.62 48.22,23.37 v51.5,23.37 | v25.44,37.55 23.84,39.15 | v112.69,38.23 112.31,37.85 111.54,37.85 S5.2 111.47,37.7 109.87,37.7 109.64,37.47 | v101.71,34.04 102.1,34.04 102.63,33.51 | 102.63,33.51 105.68,33.51 109.64,37.47 | S3.2 109.26,54.31 107.81,55.76 104.76,55.76 102.7,53.7 98.44,53.7 | 98.44,53.7 96.76,53.7 95.08,55.38 TP9.TP | 98.44,53.7 98.44,45.4 IC4.2 102.02,41.81 105.3,41.81 109.64,37.47
  Bottom 0.305: v62.17,35.87 70.62,35.87 70.7,35.95 71.54,35.95 v74.21,33.28 | v68.72,21.62 66.05,21.62 S1.2 65.9,21.62 65.6,21.93 61.1,21.93 59.35,23.68 v59.35,23.91 | v78.09,25.51 S2.2 | v100.42,29.39 102.55,31.53 102.55,33.43 102.63,33.51
  pour Top: 0.06,68.71 127.06,68.71 127.06,0.13 0.06,0.13
  pour Bottom: 0.06,68.71 127.06,68.71 127.06,0.13 0.06,0.13
IO1_0  (via drill 0.38)
  Top 0.152: v61.56,19.79 60.95,20.4 60.95,20.86 61.18,21.09 61.18,24.29 64.99,28.1 65.37,28.1 IC5.31
  Bottom 0.152: v61.56,19.79 63.39,19.79 66.13,17.05 S1.4
IO1_1  (via drill 0.38)
  Top 0.152: v61.56,20.63 61.56,24.06 64.99,27.49 65.37,27.49 IC5.32
  Bottom 0.152: v61.56,20.63 60.95,20.02 60.95,18.42 66.51,12.86 66.51,10.95 67.04,10.42 72.99,10.42 78.24,15.68 S2.4
IO1_2  (via drill 0.38)
  Top 0.152: v71.92,26.8 65.44,26.8 IC5.33 | v75.35,23.37 76.95,23.37 77.33,23.75 82.82,23.75 v83.81,24.75
  Bottom 0.152: v75.35,23.37 v71.92,26.8 | v83.81,24.75 96.61,24.75 104.99,33.13 105.91,33.13 109.03,36.25 112.23,36.25 113.3,37.32 113.3,43.8 107.05,50.04 107.05,54.16 S3.4
IO1_3  (via drill 0.38)
  Top 0.152: v10.35,43.95 10.35,40.14 10.88,39.6 10.88,38.84 11.65,38.08 11.95,38.08 12.71,37.32 12.71,35.34 13.47,34.57 14.24,34.57 23.61,25.2 23.61,23.37 33.29,13.7 37.63,13.7 45.63,5.7 60.64,5.7 66.51,11.56 66.51,25.51 65.82,26.19 65.44,26.19 IC5.34
  Bottom 0.152: v10.35,43.95 10.35,49.97 9.97,50.35 9.97,56.44 10.96,57.43 12.94,57.43 S4.4
IO4_0  (via drill 0.38)
  Top 0.152: IC1.3 96.08,22.92 95.54,22.92 94.4,24.06 94.4,26.04 90.67,29.77 88.38,29.77 81.14,37.01 77.25,37.01 74.28,34.04 73.14,34.04 IC5.17 73.06,33.97 71.16,33.97 v70.02,32.82 | v28.03,55.68 31,58.65 31,61.7 28.11,64.6 v16.29,64.6 | v41.44,22.46 v33.29,22.46 | v43.35,24.36 45.02,24.36 46.55,25.89 52.72,25.89 53.25,26.42 IC2.3 56.38,26.42 v60.72,30.76 | v68.19,32.67 68.19,32.52 v66.43,30.76
  Bottom 0.152: v28.03,55.68 28.41,55.3 29.17,55.3 X1.17 | v16.29,64.6 2.58,50.88 2.58,39.6 16.68,25.51 29.32,25.51 32.37,22.46 v33.29,22.46 | v43.35,24.36 v41.44,22.46 | v70.02,32.82 68.34,32.82 v68.19,32.67 | v60.72,30.76 v66.43,30.76
IO4_1  (via drill 0.38)
  Top 0.152: 70.89,34.54 69.41,33.05 69.41,30.54 68.41,29.55 v66.43,29.55 | 70.89,34.54 71.01,34.65 73.06,34.65 IC5.18 | v58.66,29.55 56.53,29.55 54.7,27.72 54.24,27.72 IC2.4 | v19.11,54.84 v22.24,54.84 | v3.95,50.88 3.95,40.37 v6.39,37.93 | IC1.4 95.62,24.14 94.7,25.05 94.7,27.11 91.5,30.31 v91.5,33.51 | v90.59,34.42 87.39,37.62 72.53,37.62 70.4,35.49 70.4,35.03 70.89,34.54
  Bottom 0.152: v58.66,29.55 60.11,29.55 | 60.11,29.55 v66.43,29.55 | v22.24,54.84 29.17,54.84 X1.18 | v19.11,54.84 17.82,54.84 14.92,57.74 10.81,57.74 v3.95,50.88 | v6.39,37.93 7.15,37.93 19.27,25.81 29.48,25.81 32.22,23.07 33.52,23.07 36.03,20.55 36.03,15.91 37.33,14.61 42.05,14.61 42.35,14.92 59.35,14.92 61.4,12.86 61.4,11.03 62.01,10.42 62.85,10.42 63.46,11.03 63.46,15.45 58.43,20.48 58.43,24.29 59.5,25.35 59.73,25.35 60.11,25.74 60.11,29.55 | v90.59,34.42 v91.5,33.51
IO4_2  (via drill 0.38)
  Top 0.152: v71.01,35.26 73.06,35.26 IC5.19 73.14,35.34 75.12,37.32 81.29,37.32 84.19,34.42 v89.75,34.42 | v50.66,33.36 51.04,33.36 52.87,31.53 54.17,31.53 IC2.7 54.24,31.45 54.7,31.45 55.69,30.46 v55.69,29.62 | v25.59,54.23 24.45,54.23 v22.09,51.87 | v15.53,45.09 15.07,44.63 15.07,43.03 16.07,42.04 16.07,33.28 v26.89,22.46 | v50.36,13.47 54.62,17.73 v54.62,22.08 | IC1.7 96.61,27.95 97.45,28.78 97.45,29.62 97.22,29.85 v94.32,29.85
  Bottom 0.152: v71.01,35.26 53.25,35.26 51.35,33.36 v50.66,33.36 | v25.59,54.23 29.17,54.23 X1.19 | v22.09,51.87 17.13,46.92 17.13,46.46 16.29,45.62 16.07,45.62 v15.53,45.09 | v26.89,22.46 28.56,22.46 38.39,12.63 49.52,12.63 v50.36,13.47 | v54.62,22.08 54.62,28.56 v55.69,29.62 | v89.75,34.42 v94.32,29.85
IO4_3  (via drill 0.38)
  Top 0.152: 51.69,34.77 53.63,32.82 54.17,32.82 IC2.8 | 51.69,34.77 51.65,34.8 51.65,35.79 52.34,36.48 62.4,36.48 63.54,35.34 65.37,35.34 IC5.20 | v30.39,53.62 29.78,53.02 29.78,38.61 30.01,38.38 30.01,37.09 v29.4,36.48 | v29.78,33.51 v28.11,35.18 | v43.27,32.14 v39.84,28.71 | v51.65,34.73 51.69,34.77 | v93.48,29.62 93.87,29.24 96.08,29.24 IC1.8 | v87.08,29.62 80.61,36.1 v78.47,36.1
  Bottom 0.152: v30.39,53.62 30.24,53.78 29.25,53.78 X1.20 | v28.11,35.18 v29.4,36.48 | v29.78,33.51 30.62,33.51 32.98,31.15 32.98,30.84 33.36,30.46 38.09,30.46 v39.84,28.71 | v43.27,32.14 47.99,32.14 50.58,34.73 v51.65,34.73 52.26,34.73 54.7,37.17 77.56,37.17 78.47,36.25 v78.47,36.1 | v87.08,29.62 v93.48,29.62
IO4_4  (via drill 0.38)
  Top 0.152: v55.69,34.65 65.37,34.65 IC5.21 65.44,34.73 65.9,34.73 v67.73,36.56 | v49.44,32.75 47.54,32.75 IC2.13 47.46,32.75 45.48,32.75 43.65,30.92 v43.19,30.92 | v28.03,52.86 28.03,38.69 v29.4,37.32 | v31.53,35.18 31.53,33.97 34.2,31.3 v39.84,31.3 | v77.48,36.4 77.79,36.71 80.84,36.71 88.3,29.24 89.37,29.24 IC1.13
  Bottom 0.152: v55.69,34.65 53.1,34.65 51.19,32.75 v49.44,32.75 | v28.03,52.86 28.41,53.24 29.17,53.24 X1.21 | v31.53,35.18 v29.4,37.32 | v39.84,31.3 42.81,31.3 v43.19,30.92 | v77.48,36.4 67.88,36.4 v67.73,36.56
IO4_5  (via drill 0.38)
  Top 0.152: v56.38,33.97 65.37,33.97 IC5.22 | v50.43,31.53 47.54,31.53 IC2.14 | v30.39,52.79 31.69,52.79 33.44,51.03 33.44,32.9 34.43,31.91 v40.45,31.91 | IC1.14 83.05,27.95 80.61,30.38 80.23,30.38 80.07,30.54 80.07,32.21 79.62,32.67 v75.04,32.67
  Bottom 0.152: v30.39,52.79 29.25,52.79 X1.22 | v40.45,31.91 42.66,31.91 43.04,31.53 v50.43,31.53 52.87,33.97 v56.38,33.97 72.22,33.97 73.52,32.67 v75.04,32.67
IO4_6  (via drill 0.38)
  Top 0.152: v55.77,33.36 65.37,33.36 IC5.23 | v49.14,27.79 47.61,27.79 47.54,27.72 IC2.17 | v17.21,42.5 17.21,42.19 17.67,41.74 17.67,36.78 17.89,36.56 17.89,32.29 v26.89,23.3 | v50.36,14.31 50.36,16.97 51.04,17.66 v51.04,22.08 | IC1.17 88.53,24.14 v87.92,23.53
  Bottom 0.152: v55.77,33.36 54.7,33.36 v49.14,27.79 49.21,27.79 52.11,24.9 52.11,23.14 v51.04,22.08 | v17.21,42.5 18.96,44.25 18.96,48.29 21.7,51.03 23.76,51.03 24.83,52.1 26.5,52.1 26.66,52.25 29.17,52.25 X1.23 | v26.89,23.3 28.18,23.3 37.17,14.31 42.2,14.31 42.28,14.38 50.28,14.38 v50.36,14.31 55.46,9.2 72.61,9.2 72.91,9.51 74.82,9.51 87.92,22.61 v87.92,23.53
IO4_7  (via drill 0.38)
  Top 0.152: v57.67,32.67 65.37,32.67 IC5.24 | v51.5,26.5 47.61,26.5 IC2.18 46.62,26.42 45.4,25.2 v43.35,25.2 | v21.7,45.7 21.7,45.17 24.52,42.35 24.52,40.44 24.83,40.14 24.83,35.03 v24.75,34.96 | v38.09,25.2 v36.87,26.42 | v82.51,26.88 86.47,22.92 89.37,22.92 IC1.18 | v76.8,30.38 75.73,31.45 v74.28,31.45
  Bottom 0.152: v51.5,26.5 v57.67,32.67 58.43,33.43 72.3,33.43 v74.28,31.45 | v21.7,45.7 21.7,50.35 22.09,50.73 23.91,50.73 24.98,51.8 29.17,51.8 X1.24 | v24.75,34.96 26.28,34.96 34.81,26.42 v36.87,26.42 | v43.35,25.2 v38.09,25.2 | v82.51,26.88 80.3,26.88 v76.8,30.38
LADC  (via drill 0.38)
  Top 0.152: 99.73,28.86 99.73,29.55 100.19,30 102.1,30 103.7,28.4 U$1.P$4 | 99.73,28.86 99.73,27.79 100.34,27.18 100.34,26.35 R20.1 | v78.47,29.7 76.64,29.7 76.26,30.08 73.14,30.08 IC5.11 | 99.73,28.86 v99.43,28.86
  Bottom 0.152: v78.47,29.7 86.17,29.7 87.01,28.86 v99.43,28.86
LCLOCK
  Top 0.152: IC1.16 89.45,25.35 89.98,25.35 90.82,24.52 90.82,21.24 90.51,20.94 84.57,20.94 77.71,14.08 77.71,9.05 X2.3
LCLR
  Top 0.152: IC1.19 89.37,21.54 84.72,21.54 76.87,13.7 76.87,9.05 X2.2
LD_/C  (via drill 0.38)
  Top 0.152: IC5.29 63.84,29.47 59.73,25.35 55.77,25.35 55.38,25.74 53.02,25.74 50.36,23.07 v50.36,17.81
  Bottom 0.152: X1.9 29.17,59.34 28.49,59.34 28.26,59.57 28.26,60.79 24.07,64.98 18.5,64.98 R47.1 18.5,64.9 17.89,64.29 17.89,58.88 17.59,58.58 10.81,58.58 2.88,50.65 2.88,39.76 3.26,39.38 12.03,39.38 16.83,34.57 22.39,34.57 32.07,24.9 33.06,24.9 41.82,16.13 48.3,16.13 49.97,17.81 v50.36,17.81
LDIN
  Top 0.152: IC1.15 89.45,26.65 89.98,26.65 91.12,25.51 91.12,20.25 89.75,18.88 87.01,18.88 78.47,10.34 78.47,9.05 X2.4
LEDK1  (via drill 0.38)
  Top 0.152: v26.28,52.71 26.28,47.53 v26.81,47
  Bottom 0.152: v26.28,52.71 24.68,54.31 23.76,54.31 23.08,53.62 22.92,53.62 R37.2 | v26.81,47 28.49,45.32 29.17,45.32 X1.37
LEDK2  (via drill 0.38)
  Top 0.152: v12.94,43.11 12.79,43.26 12.79,44.02 R38.2
  Bottom 0.152: v12.94,43.11 14.39,43.11 19.88,37.62 19.88,37.01 19.95,36.94 25.97,36.94 30.09,41.05 30.09,44.56 29.86,44.79 29.25,44.79 X1.38
LEDK3
  Bottom 0.152: R39.2 29.17,44.33 X1.39
LEDK4
  Bottom 0.152: R40.2 24.37,41.81 24.68,41.81 26.66,43.8 29.17,43.8 X1.40
LHVTRIG  (via drill 0.38)
  Top 0.152: v104.84,29.7 108.04,29.7 109.26,28.48 110.78,28.48 R13.1 | v79.16,22.92 78.4,22.15 75.65,22.15 v75.27,22.54 | v70.4,27.41 67.2,27.41 65.82,28.78 65.44,28.78 IC5.30
  Bottom 0.152: v104.84,29.7 102.02,29.7 96.46,24.14 80.38,24.14 v79.16,22.92 | v70.4,27.41 v75.27,22.54
LLED  (via drill 0.38)
  Top 0.152: R41.1 22.85,39.68 21.02,41.51 20.56,41.51 R43.1 20.49,41.59 20.49,41.81 v19.88,42.42 | R44.1 16.9,44.02 16.6,43.72 v16.6,43.11 16.6,42.27 16.68,42.19 16.68,41.59 R42.1 16.75,41.51 17.13,41.13 v17.13,36.48 | v71.69,30.38 72.68,31.37 73.06,31.37 IC5.13 | v64.07,22.61 64.07,21.47 61.79,19.18 v56.83,19.18
  Bottom 0.152: v71.69,30.38 71.69,29.55 64.76,22.61 v64.07,22.61 | v56.83,19.18 39.23,19.18 33.21,25.2 32.22,25.2 22.54,34.88 18.73,34.88 v17.13,36.48 | v19.88,42.42 17.97,42.42 17.44,41.89 16.98,41.89 16.6,42.27 v16.6,43.11
LRD  (via drill 0.38)
  Top 0.152: IC5.10 71.77,29.47 71.08,30.16 70.62,30.16 v69.79,29.32 | v57.52,20.4 v60.57,23.45 | v38.85,20.4 34.89,20.4 32.91,18.42 29.48,18.42 27.8,20.1 27.8,27.03 25.97,28.86 25.97,32.82 18.28,40.52 18.28,42.5 18.12,42.65 18.12,44.94 14.47,48.6 14.47,53.93 v17.21,56.67
  Bottom 0.152: X1.11 29.17,58.27 28.49,58.27 28.26,58.04 28.26,57.82 25.82,55.38 22.62,55.38 18.73,59.26 18.5,59.26 R50.1 18.5,59.19 18.5,59.04 17.74,58.27 17.74,57.21 v17.21,56.67 | v69.79,29.32 69.56,29.09 69.56,29.01 64,23.45 v60.57,23.45 | v38.85,20.4 v57.52,20.4
LRESET  (via drill 0.38)
  Top 0.152: v34.66,32.52 40.83,32.52 42.89,34.57 50.28,34.57 52.64,32.21 55.23,32.21 55.99,31.45 65.37,31.45 IC5.26 | v32.52,33.81 32.52,51.11 v31.76,51.87
  Bottom 0.152: v34.66,32.52 33.82,32.52 v32.52,33.81 | v31.76,51.87 31.76,59.19 30.62,60.33 29.25,60.33 X1.7
LTS+  (via drill 0.38)
  Top 0.152: 98.02,15.56 97.98,15.6 97.14,15.6 88.84,7.3 X3.1 | 98.02,15.56 98.67,14.92 98.82,14.92 R12.2 | v108.27,30.31 112.38,34.42 125.03,34.42 125.34,34.12 125.34,21.62 121.75,18.04 121.75,9.58 F1.P$4 | v98.06,20.63 98.06,15.6 98.02,15.56
  Bottom 0.152: v108.27,30.31 107.28,29.32 106.74,29.32 v98.06,20.63
LTS-
  Top 0.152: R12.1 97.52,14.84 97.52,14 93.41,9.89 93.41,5.85 X3.2
  Bottom 0.152: F1.P$3 121.68,19.72 121.68,37.93 120.61,38.99 116.19,38.99 110.93,33.74 110.02,33.74 108.88,32.59 108.88,30.08 107.81,29.01 106.9,29.01 98.67,20.78 98.67,15.14 93.41,9.89 93.41,5.85 X3.2
LVSEL  (via drill 0.38)
  Top 0.152: v77.94,32.06 73.14,32.06 IC5.14 | v87.85,32.06 89.07,32.06 89.37,31.76 IC1.11
  Bottom 0.152: v87.85,32.06 v77.94,32.06
LWR  (via drill 0.38)
  Top 0.152: v19.8,61.24 20.56,61.24 22.54,63.23 26.05,63.23 v30.39,58.88 30.31,58.88 27.42,55.99 27.42,37.62 31.53,33.51 31.53,32.29 33.36,30.46 33.74,30.46 36.18,28.02 41.21,28.02 43.95,30.76 48.76,30.76 49.44,30.08 v52.26,30.08 | v70.85,29.55 71.54,28.86 73.06,28.86 IC5.9 | v56.22,32.06 v58.28,32.06
  Bottom 0.152: v19.8,61.24 18.5,61.24 R49.1 | v30.39,58.88 29.32,58.88 29.25,58.81 X1.10 | v70.85,29.55 68.34,32.06 v58.28,32.06 | v56.22,32.06 54.24,32.06 v52.26,30.08
N$1  (via drill 0.38)
  Top 0.152: v96.23,42.5 96.3,42.5 97.45,43.64 97.45,45.55 98.13,46.23 99.35,46.23 99.73,46.61 99.73,47.07 97.9,48.9 97.9,49.13 R1.1 | v102.93,34.19 102.93,30.76 104.84,28.86 104.84,27.79 98.67,21.62 96.15,21.62 IC1.2
  Bottom 0.152: v96.23,42.5 96.23,41.36 94.48,39.6 94.48,39.15 98.97,34.65 102.48,34.65 v102.93,34.19
N$2
  Top 0.152: R2.1 102.32,32.59 97.45,27.72 97.45,26.27 96.61,25.43 96.15,25.43 IC1.5
N$3
  Top 0.152: R3.1 95.92,33.81 92.88,30.76 92.88,29.39 95.54,26.73 96.08,26.73 IC1.6
N$4
  Top 0.152: R4.1 96,37.7 96,36.25 96.53,35.72 96.53,33.97 94.7,32.14 94.7,31.37 95.54,30.54 96.08,30.54 IC1.9
N$5
  Top 0.152: R5.1 111.54,44.79 110.48,44.79 109.49,45.78 108.5,45.78 107.73,45.01 107.73,44.56 106.74,43.57 103.85,43.57 101.94,41.66 98.97,41.66 95.77,38.46 95.54,38.46 90.82,33.74 90.82,31.37 89.98,30.54 89.45,30.54 IC1.12
N$6
  Top 0.152: T8.1 97.83,59.72 101.33,63.23 104.53,63.23 106.51,61.24 106.51,60.94 108.04,59.42 L3.2 108.12,59.42 109.26,60.56 112.38,60.56 SG1.-
N$7  (via drill 0.38)
  Top 0.152: T4.3 108.72,45.09 106.44,42.8 105.22,42.8 v103.54,41.13 | v98.06,38.54 97.29,37.78 R4.2
  Bottom 0.152: v103.54,41.13 100.65,41.13 v98.06,38.54
N$8
  Top 0.152: T5.3 114.06,41.28 111.93,43.41 111.62,43.41 R5.2
N$9
  Top 0.152: 105.68,27.72 105.68,26.95 102.7,23.98 102.7,19.72 F1.P$1 | 105.68,27.72 105.68,28.4 D2.A | 105.68,27.72 118.25,27.72 121.91,31.37 H1.4
N$10
  Top 0.152: T1.1 102.25,52.94 R7.1
N$11  (via drill 0.38)
  Top 0.152: v104.46,45.09 101.94,42.58 101.64,42.58 T2.1 | v105.83,53.02 112.08,53.02 115.05,55.99 121.53,55.99 121.68,55.83 121.68,54.08 120.69,53.09 120.69,50.42 121.3,49.81 R8.1
  Bottom 0.152: v104.46,45.09 104.46,51.64 v105.83,53.02
N$12
  Top 0.152: T3.1 121.98,53.17 121.98,52.33 121.37,51.72 R9.1
N$13
  Top 0.152: T1.3 99.5,49.51 99.2,49.21 R1.2
N$14
  Top 0.152: T2.3 100.72,40.52 100.72,39.3 101.33,38.69 101.33,35.49 101.03,35.18 R2.2
N$15  (via drill 0.38)
  Top 0.152: T3.3 122.97,52.48 125.11,50.35 125.11,35.18 124.96,35.03 v103.16,35.03 | v99.2,35.26 97.37,35.26 97.29,35.18 R3.2
  Bottom 0.152: v103.16,35.03 99.43,35.03 v99.2,35.26
N$16
  Top 0.152: T4.1 108.04,43.11 110.1,43.11 111.09,44.1 112.69,44.1 115.66,47.07 121.15,47.07 121.3,47.22 R10.1
N$17
  Top 0.152: R7.2 103.62,52.94 103.62,50.65 103.85,50.42 C1.2 110.71,50.42 113.45,47.68 119.47,47.68 120.08,48.29 122.67,48.29 | R9.2 122.67,51.64 122.67,49.81 R8.2 122.67,49.74 122.67,48.29 | 122.67,48.29 122.67,47.3 R10.2 122.67,47.22 122.67,44.71 R11.2 122.59,44.71 121.98,44.1 IC7.7
N$18  (via drill 0.38)
  Top 0.152: 102.97,47.57 102.02,46.61 C5.1 | 102.97,47.57 103.01,47.61 104.69,47.61 104.91,47.38 119.62,47.38 120.23,47.99 121.75,47.99 121.98,47.76 121.98,46.77 121.37,46.16 121.37,44.71 R11.1 121.3,44.71 121.3,39.3 v120.38,38.38 | 102.97,47.57 102.02,48.52 102.02,50.42 C1.1 | IC7.1 120.69,36.4 119.01,36.4 C6.1 118.94,36.4 118.4,36.4 v117.64,35.64 | v107.12,28.4 108.19,28.4 D2.C
  Bottom 0.152: F1.P$2 101.71,10.5 101.71,22.99 v107.12,28.4 111.54,28.4 117.64,34.5 v117.64,35.64 v120.38,38.38
N$19
  Top 0.152: D1.A 15.15,29.24 14.62,29.24 12.48,31.37 H2.4 5.78,31.37 5.17,30.76 5.17,19.94 F2.P$1
N$20
  Top 0.152: R15.1 8.52,45.55 10.27,45.55 10.58,45.24 11.49,45.24 11.65,45.4 11.65,47.15 11.34,47.45 11.34,48.6 11.49,48.75 13.47,48.75 17.82,44.4 17.82,42.04 17.97,41.89 17.97,39.38 25.67,31.68 25.67,25.35 27.5,23.53 27.5,19.94 33.44,14 38.16,14 46.16,6 51.04,6 52.87,7.83 52.87,8.97 54.32,10.42 55.23,10.42 56.22,11.41 56.22,19.94 59.96,23.68 59.96,24.14 59.04,25.05 54.32,25.05 54.24,25.13 IC2.2
N$21
  Top 0.152: R13.2 112.15,28.48 112.15,31.15 114.59,33.58 H1.1
N$22
  Top 0.152: T8.3 96.91,57.66 96.91,60.25 97.83,61.17 R14.2
N$23  (via drill 0.38)
  Top 0.305: v110.25,33.13 103.77,33.13 U$1.P$1 | v113.75,31.45 113.75,30 114.59,29.16 H1.3
  Bottom 0.305: v110.25,33.13 112.08,33.13 v113.75,31.45
N$24  (via drill 0.38)
  Top 0.152: v9.74,49.66 11.95,49.66 12.71,50.42 R16.1 | v8.29,37.62 v8.29,40.67 | v32.07,27.56 v28.11,27.56 | v45.17,25.81 v42.74,25.81 | v49.44,28.94 54.17,28.94 IC2.5
  Bottom 0.152: v9.74,49.66 9.74,42.12 v8.29,40.67 | v8.29,37.62 18.35,27.56 v28.11,27.56 | v32.07,27.56 33.21,27.56 34.96,25.81 v42.74,25.81 | v45.17,25.81 46.32,25.81 v49.44,28.94
N$25  (via drill 0.38)
  Top 0.152: v10.58,50.58 9.82,50.58 9.21,49.97 8.37,49.97 R17.1 | v15.07,50.58 21.7,50.58 24.83,47.45 24.83,40.59 25.74,39.68 25.74,38.38 30.39,33.74 v30.39,32.9 | v36.79,29.85 38.01,28.63 38.47,28.63 43.19,33.36 49.82,33.36 52.95,30.23 IC2.6
  Bottom 0.152: v15.07,50.58 v10.58,50.58 | v30.39,32.9 33.44,29.85 v36.79,29.85
N$26  (via drill 0.38)
  Top 0.152: v17.74,48.37 17.74,45.78 18.5,45.01 18.5,42.73 18.58,42.65 18.58,41.05 v24.07,35.57 | v33.59,31.07 33.97,31.07 36.72,28.33 38.62,28.33 43.04,32.75 v44.64,32.75 | v52.26,35.57 52.79,35.03 52.79,34.96 53.71,34.04 IC2.9
  Bottom 0.152: R18.1 19.65,57.66 21.63,55.68 21.63,52.25 v17.74,48.37 | v24.07,35.57 26.12,35.57 27.57,34.12 30.54,34.12 v33.59,31.07 | v44.64,32.75 48.15,32.75 50.97,35.57 v52.26,35.57
N$27  (via drill 0.38)
  Top 0.152: v29.4,38.16 29.4,53.47 31.31,55.38 31.31,61.85 27.95,65.21 12.79,65.21 R19.1 | v27.5,35.79 27.5,34.96 v28.94,33.51 | v38.24,29.24 38.62,29.24 43.42,34.04 IC2.12
  Bottom 0.152: v29.4,38.16 27.5,36.25 v27.5,35.79 | v28.94,33.51 33.21,29.24 v38.24,29.24
N$28  (via drill 0.38)
  Top 0.152: v24.22,47.22 18.58,47.22 v18.35,47 | v16.37,45.01 16.37,44.79 15.68,44.1 R44.2
  Bottom 0.152: v24.22,47.22 24.52,46.92 24.52,46.23 T13.3 | v16.37,45.01 v18.35,47
N$29
  Top 0.152: T6.3 10.96,46 9.21,46 8.9,46.31 7.91,46.31 7.23,45.62 R15.2
N$30
  Top 0.152: T7.3 13.25,53.93 13.09,53.93 11.49,52.33 11.49,50.42 R16.2
N$31
  Top 0.152: T9.3 8.45,56.06 11.26,56.06 11.65,56.44 12.64,56.44 12.79,56.29 12.79,54.69 11.95,53.85 11.95,53.4 9.21,50.65 7.76,50.65 7.07,49.97 R17.2
N$32  (via drill 0.38)
  Top 0.152: v16.22,57.74 13.17,57.74 T10.3
  Bottom 0.152: v16.22,57.74 16.98,57.74 R18.2
N$33
  Top 0.152: T11.3 13.09,62.92 13.09,63.53 11.49,65.13 R19.2
N$35
  Top 0.152: T6.1 11.95,47.99 11.95,45.24 11.49,44.79 10.35,44.79 9.74,44.18 9.74,39.45 10.2,38.99 R22.1
N$36
  Top 0.152: T7.1 12.33,51.95 13.17,51.11 13.25,51.11 13.4,50.96 13.4,49.89 12.56,49.05 9.59,49.05 8.22,47.68 R23.1
N$37
  Top 0.152: T9.1 6.46,56.98 6.46,56.06 7.68,54.84 7.68,52.56 7.07,51.95 R24.1
N$38
  Top 0.152: T10.1 9.74,55.76 8.37,54.39 R25.1
N$39  (via drill 0.38)
  Top 0.152: R26.2 14.01,38.99 14.01,36.71 13.78,36.48 C2.2 13.7,36.4 v13.7,35.18 | 6.5,51.3 6.54,51.26 7.61,51.26 8.29,51.95 R24.2 | 6.5,51.3 6.39,51.42 6.39,52.48 7,53.09 7,54.31 R25.2 | 6.5,51.3 6.46,51.26 6.46,50.5 6.39,50.42 6.39,48.14 6.85,47.68 R23.2 6.85,47.61 6.54,47.3 6.54,45.09 8.9,42.73 8.9,38.99 R22.2 8.98,38.99 v9.97,38 | v7,38.61 4.56,41.05 4.56,41.59 IC8.7
  Bottom 0.152: v13.7,35.18 12.79,35.18 v9.97,38 9.36,38.61 v7,38.61
N$40  (via drill 0.38)
  Top 0.152: C8.1 30.16,19.49 30.16,23.91 29.93,24.14 C7.1 29.86,24.14 v29.86,26.27 | 11.87,35.03 11.87,36.4 C2.1 11.8,36.48 11.11,37.17 v11.11,37.78 | 11.87,35.03 11.87,33.2 12.18,32.9 12.56,32.9 16.22,29.24 17.67,29.24 D1.C | R26.1 12.18,38.99 v11.87,38.69 | 3.68,35.45 4.1,35.03 11.87,35.03 | 3.68,35.45 3.26,35.87 3.26,36.33 IC8.1 | 3.68,35.45 2.43,34.19 2.43,20.94 5.09,18.27 5.09,9.81 F2.P$2
  Bottom 0.152: v11.11,37.78 11.87,38.54 v11.87,38.69 11.87,38.46 16.07,34.27 22.24,34.27 29.86,26.65 v29.86,26.27
N$41
  Bottom 0.152: T12.1 23.61,52.1 23.61,53.02 24.14,53.55 R37.1
N$42  (via drill 0.38)
  Top 0.152: v68.64,8.59 71.54,11.49 71.54,21.32 R21.2 | v13.25,28.1 13.25,29.01 13.17,29.09 H2.1
  Bottom 0.152: v68.64,8.59 55.23,8.59 51.5,12.32 35.8,12.32 22.92,25.2 16.14,25.2 v13.25,28.1
N$43
  Top 0.152: T15.1 11.95,42.73 11.95,43.57 11.49,44.02 R38.1
N$44  (via drill 0.38)
  Top 0.152: v22.01,44.02 22.01,44.18 20.87,45.32 20.1,45.32 T14.1
  Bottom 0.152: v22.01,44.02 22.69,44.02 23,44.33 R39.1
N$45
  Top 0.152: T5.1 113.14,39.22 113.83,39.22 115.28,37.78 123.66,37.78 124.5,36.94 124.5,36.4 IC7.4
N$46
  Bottom 0.152: T13.1 23.61,48.21 23.61,44.94 23.69,44.86 23.69,42.42 23.08,41.81 R40.1
N$47
  Top 0.152: T11.1 12.1,60.79 8.98,60.79 5.7,57.51 5.7,44.71 7.61,42.8 7.61,36.94 7.07,36.4 IC8.4
N$48
  Top 0.152: T14.3 19.19,43.26 19.19,41.59 R43.2
N$49  (via drill 0.38)
  Top 0.152: v25.44,41.74 v25.44,46.84 | v23.91,40.59 23.91,39.91 24.14,39.68 R41.2
  Bottom 0.152: v25.44,46.84 24.6,47.68 24.6,50.04 T12.3 | v25.44,41.74 24.3,40.59 v23.91,40.59
N$50
  Top 0.152: T15.3 11.04,40.59 11.8,40.59 12.48,39.91 13.78,39.91 15.38,41.51 R42.2
N$51  (via drill 0.38)
  Top 0.305: v18.5,32.9 23,32.9 U$2.P$1 | v14.47,33.51 13.25,33.51 13.17,33.58 H2.3
  Bottom 0.305: v18.5,32.9 17.59,32.9 16.98,33.51 v14.47,33.51
RADC  (via drill 0.38)
  Top 0.152: U$2.P$4 27.88,32.82 28.64,32.06 30.54,32.06 R28.1 30.54,31.91 36.72,25.74 v36.72,24.9 | v59.5,25.96 64.3,30.76 65.37,30.76 IC5.27
  Bottom 0.152: v59.5,25.96 54.24,20.71 40.91,20.71 v36.72,24.9
RCLOCK
  Top 0.152: IC2.16 47.46,28.94 43.65,28.94 41.44,26.73 41.44,25.43 43.73,23.14 44.64,23.14 49.44,18.34 49.44,11.11 50.2,10.34 50.2,9.05 X4.3
RCLR
  Top 0.152: IC2.19 47.54,25.13 48.07,25.13 49.75,23.45 49.75,11.64 50.97,10.42 50.97,9.05 X4.4
RDIN
  Top 0.152: IC2.15 44.49,30.23 41.14,26.88 41.14,25.28 43.57,22.84 44.49,22.84 49.14,18.19 49.14,9.28 49.36,9.05 X4.2
RHVTRIG
  Top 0.152: R21.1 72.91,21.39 72.91,22.38 73.9,23.37 73.9,24.52 73.52,24.9 73.14,24.9 IC5.3
RTS+
  Top 0.152: F2.P$4 28.07,13.66 | 28.07,13.66 28.11,13.7 28.11,14.15 R27.2 | X5.1 39.15,2.49 39.15,3.49 33.13,9.51 33.13,10.42 29.93,13.62 28.11,13.62 28.07,13.66
RTS-
  Top 0.152: F2.P$3 24.22,19.94 28.11,16.06 28.11,15.52 R27.1 28.18,15.45 28.56,15.45 30.62,13.39 33.82,13.39 41.36,5.85 43.73,5.85 X5.2
RVSEL
  Top 0.152: IC5.25 65.44,32.14 65.9,32.14 68.34,34.57 68.34,36.78 67.96,37.17 49.36,37.17 47.54,35.34 IC2.11
SPKR  (via drill 0.38)
  Top 0.152: v96.3,58.65 96.53,58.88 96.53,61.17 R14.1 | v97.07,54.39 97.07,53.7 96.76,53.4 96.76,51.8 v97.45,51.11 | v75.58,30.76 73.14,30.76 IC5.12
  Bottom 0.152: v96.3,58.65 96.3,56.75 97.07,55.99 v97.07,54.39 | v97.45,51.11 97.45,46.23 93.94,42.73 93.94,39.53 87.69,33.28 77.86,33.28 75.58,30.99 v75.58,30.76
TCK  (via drill 0.38)
  Top 0.152: v63,21.24 63,23.53 64.99,25.51 65.37,25.51 IC5.35 | v95.08,39.38 94.25,39.38 93.18,38.31 72.3,38.31 68.8,34.8 68.8,31.22 v68.34,30.76
  Bottom 0.152: SV1.3 67.5,12.25 67.73,12.48 67.73,17.73 67.5,17.96 67.35,17.96 64.07,21.24 v63,21.24 61.18,21.24 58.74,23.68 58.74,24.14 59.12,24.52 62.24,24.52 68.34,30.61 v68.34,30.76 | v95.08,39.38 96.76,37.7 106.97,37.7 S5.4
TDI
  Top 0.152: SV1.5 66.21,15.98 66.21,23.91 65.9,24.21 65.44,24.21 IC5.37
  Bottom 0.152: S7.4 48.76,17.05 50.13,18.42 56.3,18.42 62.47,12.25 SV1.5
TDO
  Top 0.152: IC5.38 65.37,23.6 65.37,17.73 59.88,12.25 SV1.6
TEST
  Top 0.152: SV1.1 72.22,12.55 72.22,22.15 73.06,22.99 73.06,23.6 IC5.1
TMS  (via drill 0.38)
  Top 0.152: 58.93,13.43 58.89,13.39 58.89,10.95 59.42,10.42 63.16,10.42 64.91,12.17 SV1.4 | 58.93,13.43 64.68,19.18 64.68,24.59 64.99,24.9 65.37,24.9 IC5.36 | v39.38,23.07 41.67,23.07 42.2,22.54 42.2,19.18 v45.86,15.52 | 58.93,13.43 v56.83,15.52
  Bottom 0.152: v39.38,23.07 36.94,25.51 33.29,25.51 23.61,35.18 20.49,35.18 17.44,38.23 16.22,38.23 S6.4 | v56.83,15.52 v45.86,15.52
VBAT
  Top 0.152: 97.26,42.69 97.9,43.34 101.56,43.34 102.25,44.02 R46.2 | 97.26,42.69 96.15,41.59 96,41.59 R45.1 | 97.26,42.69 97.83,42.12 97.83,40.98 97.68,40.82 97.45,40.82 94.63,38 72.45,38 69.1,34.65 69.1,30.69 68.57,30.16 65.44,30.16 IC5.28
VCC  (via drill 0.38)
  Top 0.305: v49.52,6.61 48.68,7.45 48.68,8.97 X4.1 | v69.86,5.92 73.52,9.58 75.5,9.58 76.03,9.05 X2.1 | C10.1 100.57,64.37 105.45,64.37 107.96,61.85 L3.1 108.12,61.85 111.62,61.85 111.77,62.01 117.49,62.01 118.86,60.64 SG1.+ | v118.55,46.46 118.55,43.8 IC3.3
  Bottom 0.305: v49.52,6.61 52.79,6.61 53.48,5.92 v69.86,5.92 77.18,5.92 85.79,14.53 90.67,14.53 106.06,29.93 106.06,32.67 109.26,35.87 112.46,35.87 118.48,41.89 118.48,46.39 v118.55,46.46 118.55,60.25 SG1.+
XIN
  Top 0.152: IC5.6 73.14,26.88 76.64,26.88 Q3.2 78.17,28.48 79.08,29.39 79.08,31.37 C12.1
XOUT
  Top 0.152: 78.17,26.65 77.79,26.27 73.14,26.27 IC5.5 | 78.17,26.65 80.68,26.65 C11.1 | 78.17,26.65 Q3.1

### Text on the board
DrillLegend: LAYER-STACK
DrillLegend_01-16: 01-16
DrillLegend_01-20: 01-20